# EAGLE design main (EAGLE 5.11)
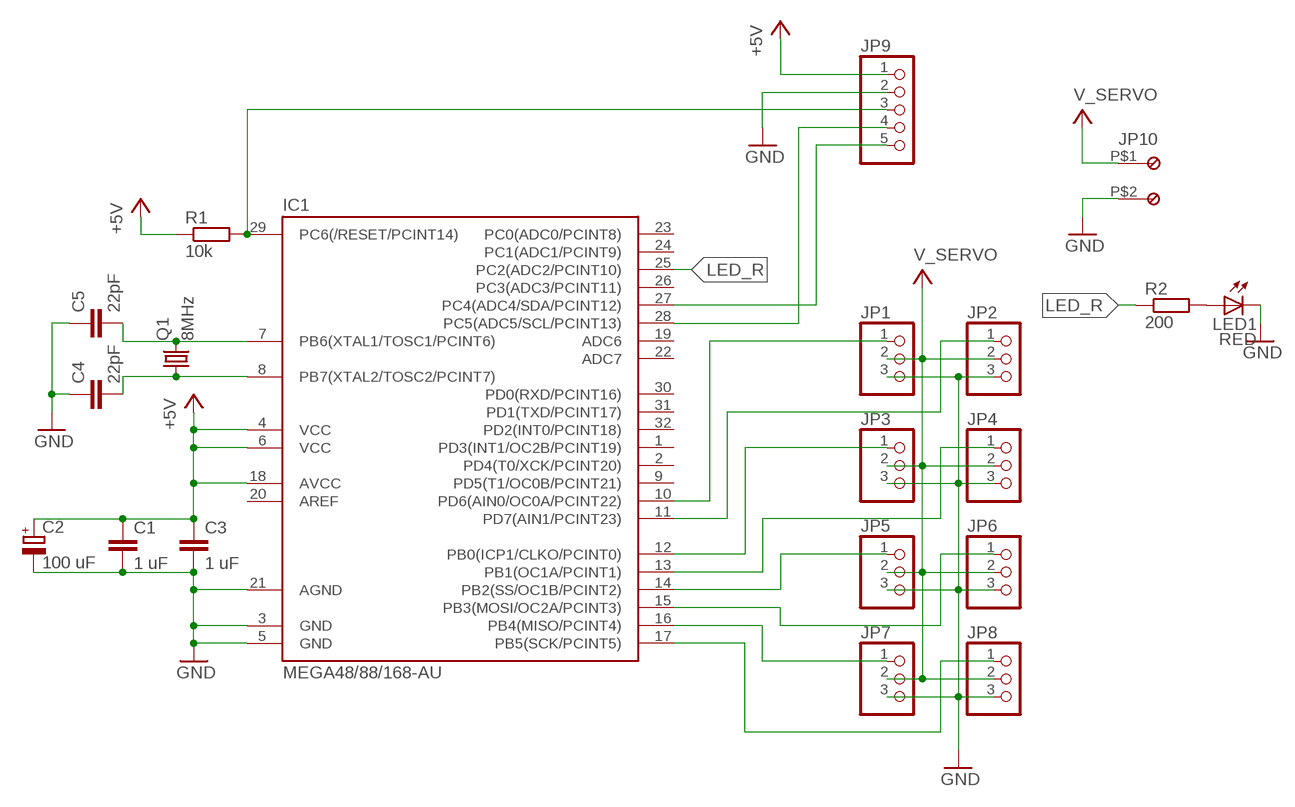
[diagram p0: schematic, sheet 1]

## Parts
C1  1 uF  C-EUC0805  [C0805]
C2  100 uF  CPOL-EUE2-5  [E2-5]
C3  1 uF  C-EUC0805  [C0805]
C4  22pF  C-EUC0805  [C0805]
C5  22pF  C-EUC0805  [C0805]
IC1  MEGA48/88/168-AU  [TQFP32-08]
JP1  PINHD-1X3  [1X03]
JP2  PINHD-1X3  [1X03]
JP3  PINHD-1X3  [1X03]
JP4  PINHD-1X3  [1X03]
JP5  PINHD-1X3  [1X03]
JP6  PINHD-1X3  [1X03]
JP7  PINHD-1X3  [1X03]
JP8  PINHD-1X3  [1X03]
JP9  PINHD-1X5  [1X05]
JP10  KLEM  KLEM5MM  [KLEMM2]
LED1  RED  LED3MM  [LED3MM]
Q1  8MHz  CRYSTALHC49S  [HC49/S]
R1  10k  R-EU_M0805  [M0805]
R2  200  R-EU_M0805  [M0805]

## Nets
+5V: C1.1 C2.+ C3.1 IC1.4(VCC) IC1.6(VCC) IC1.18(AVCC) JP9.1 R1.1
GND: C1.2 C2.- C3.2 C4.1 C5.1 IC1.3(GND) IC1.5(GND) IC1.21(AGND) JP1.3 JP2.3 JP3.3 JP4.3 JP5.3 JP6.3 JP7.3 JP8.3 JP9.2 JP10.P$2 LED1.K(C)
LED_R: IC1.25(PC2(ADC2/PCINT10)) R2.1
N$1: C4.2 IC1.8(PB7(XTAL2/TOSC2/PCINT7)) Q1.1
N$2: C5.2 IC1.7(PB6(XTAL1/TOSC1/PCINT6)) Q1.2
N$3: IC1.29(PC6(/RESET/PCINT14)) JP9.3 R1.2
N$4: IC1.28(PC5(ADC5/SCL/PCINT13)) JP9.4
N$5: IC1.27(PC4(ADC4/SDA/PCINT12)) JP9.5
N$6: IC1.16(PB4(MISO/PCINT4)) JP7.1
N$7: IC1.11(PD7(AIN1/PCINT23)) JP2.1
N$8: IC1.14(PB2(SS/OC1B/PCINT2)) JP5.1
N$9: IC1.12(PB0(ICP1/CLKO/PCINT0)) JP3.1
N$10: IC1.10(PD6(AIN0/OC0A/PCINT22)) JP1.1
N$11: LED1.A R2.2
N$13: IC1.17(PB5(SCK/PCINT5)) JP8.1
N$15: IC1.15(PB3(MOSI/OC2A/PCINT3)) JP6.1
N$16: IC1.13(PB1(OC1A/PCINT1)) JP4.1
V+: JP1.2 JP2.2 JP3.2 JP4.2 JP5.2 JP6.2 JP7.2 JP8.2 JP10.P$1 ; supply symbol labelled V_SERVO
Unconnected: IC1.1(PD3(INT1/OC2B/PCINT19)) IC1.2(PD4(T0/XCK/PCINT20)) IC1.9(PD5(T1/OC0B/PCINT21)) IC1.19(ADC6) IC1.20(AREF) IC1.22(ADC7) IC1.23(PC0(ADC0/PCINT8)) IC1.24(PC1(ADC1/PCINT9)) IC1.26(PC3(ADC3/PCINT11)) IC1.30(PD0(RXD/PCINT16)) IC1.31(PD1(TXD/PCINT17)) IC1.32(PD2(INT0/PCINT18))

## Library data of the parts
C1 C3-C5 = rcl:C-EU: CAPACITOR, European symbol
C2 = rcl:CPOL-EU: POLARIZED CAPACITOR, European symbol
IC1 = avr-7:MEGA48/88/168
JP1-JP8 = pinhead:PINHD-1X3: PIN HEADER
JP9 = pinhead:PINHD-1X5: PIN HEADER
JP10 = klemm:KLEM
LED1 = led:LED: LED OSRAM: - CHIPLED LG R971, LG N971, LY N971, LG Q971, LY Q971, LO R971, LY R971 LH N974, LH R974 LS Q976, LO Q976, LY Q976 LO Q996 - Hyper CHIPLED LW Q18S LB Q993, LB Q99A, LB R99A - SideLED LS A670, LO A670, LY A670, LG A670, LP A670 LB A673, LV A673, LT A673, LW A673 LH A674 LY A675 LS A676, LA A676, LO A676, LY A676, LW A676 LS A679, LY A679, LG A679 - Hyper Micro SIDELED® LS Y876, LA Y876, LO Y876, LY Y876 LT Y87S - SmartLED LW L88C, LW L88S LB L89C, LB L89S, LG L890 LS L89K, LO L89K, LY L89K LS L896, LA L896, LO L896, LY L896 - TOPLED LS T670, LO T670, LY T670, LG T670, LP T670 LSG T670, LSP T670, LSY T670, LOP T670, LYG T670 LG T671, LOG T671, LSG T671 LB T673, LV T673, LT T673, LW T673 LH T674 LS T676, LA T676, LO T676, LY T676, LB T676, LH T676, LSB T676, LW T676 LB T67C, LV T67C, LT T67C, LS T67K, LO T67K, LY T67K, LW E67C LS E67B, LA E67B, LO E67B, LY E67B, LB E67C, LV E67C, LT E67C LW T67C LS T679, LY T679, LG T679 LS T770, LO T770, LY T770, LG T770, LP T770 LB T773, LV T773, LT T773, LW T773 LH T774 LS E675, LA E675, LY E675, LS T675 LS T776, LA T776, LO T776, LY T776, LB T776 LHGB T686 LT T68C, LB T68C - Hyper Mini TOPLED® LB M676 - Mini TOPLED Santana® LG M470 LS M47K, LO M47K, LY M47K Source: http://www.osram.convergy.de LUXEON: - LUMILED® LXK2-PW12-R00, LXK2-PW12-S00, LXK2-PW14-U00, LXK2-PW14-V00 LXK2-PM12-R00, LXK2-PM12-S00, LXK2-PM14-U00 LXK2-PE12-Q00, LXK2-PE12-R00, LXK2-PE12-S00, LXK2-PE14-T00, LXK2-PE14-U00 LXK2-PB12-K00, LXK2-PB12-L00, LXK2-PB12-M00, LXK2-PB14-N00, LXK2-PB14-P00, LXK2-PB14-Q00 LXK2-PR12-L00, LXK2-PR12-M00, LXK2-PR14-Q00, LXK2-PR14-R00 LXK2-PD12-Q00, LXK2-PD12-R00, LXK2-PD12-S00 LXK2-PH12-R00, LXK2-PH12-S00 LXK2-PL12-P00, LXK2-PL12-Q00, LXK2-PL12-R00 Source: www.luxeon.com KINGBRIGHT: KA-3528ASYC Source: www.kingbright.com
Q1 = crystal:CRYSTAL: CRYSTAL; OC_FARNELL: 1667008; OC_NEWARK: unknown
R1 R2 = rcl:R-EU_: RESISTOR, European symbol

## Board
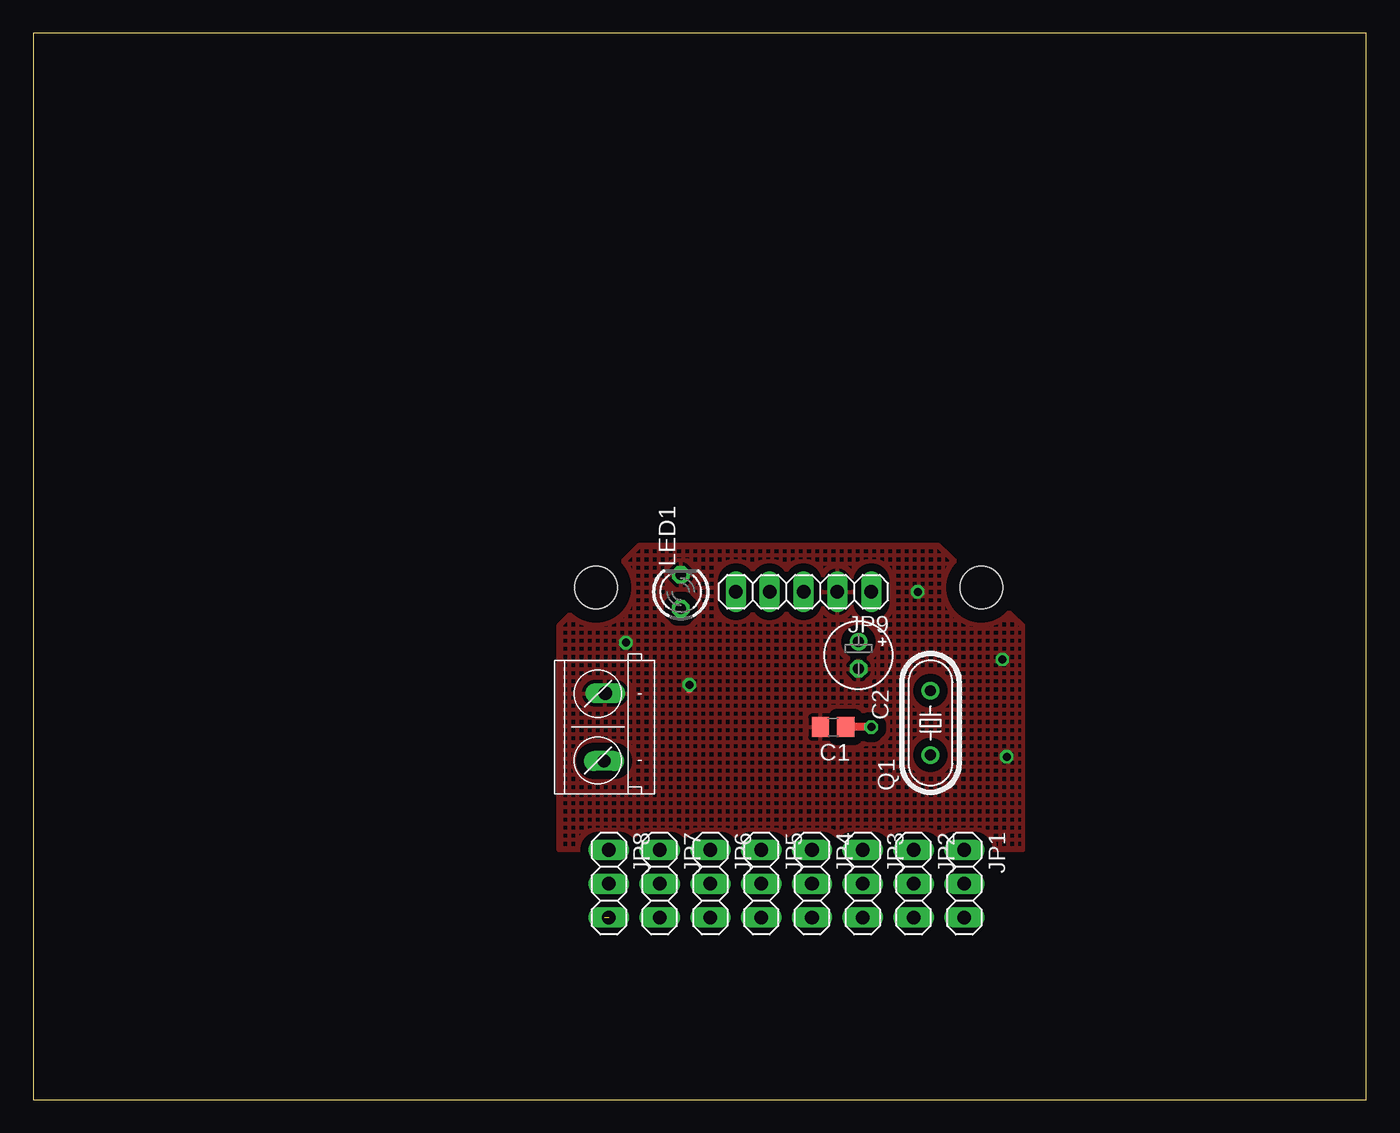
[diagram p1: board, top side]
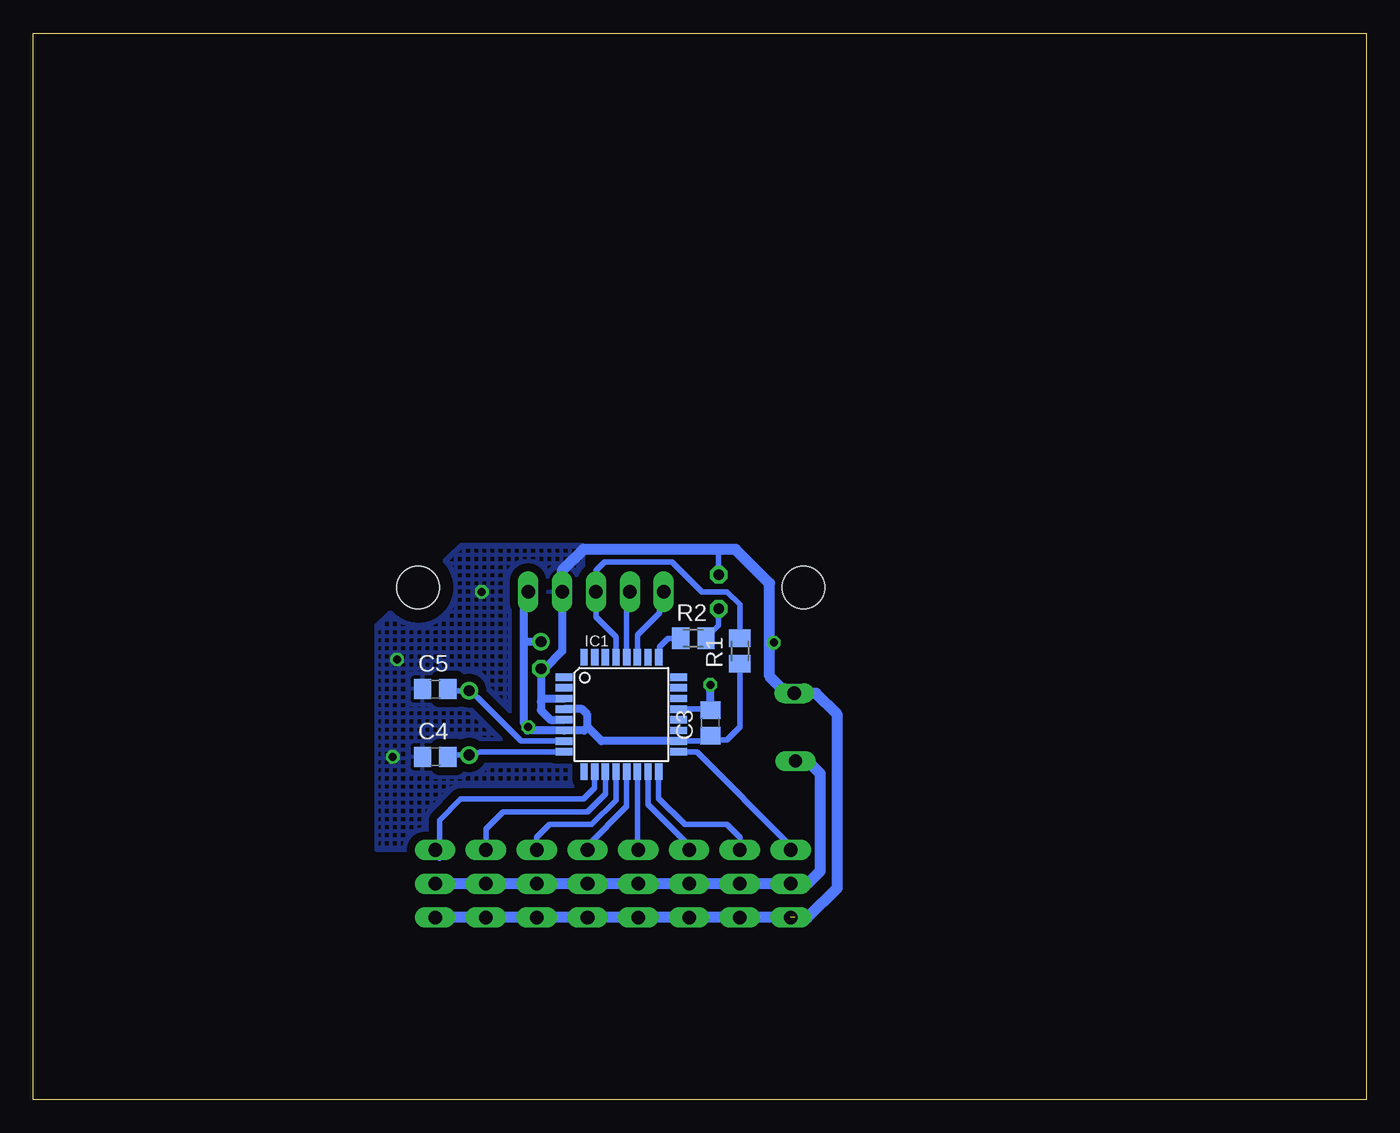
[diagram p2: board, bottom side, seen from below]

Size 100 x 80 mm. Coordinates in mm from the lower left corner, seen from the top.
Outline: 0,0 100,0 100,80 0,80 0,0
Copper layers (1*16): Top 0.035mm / dielectric 1.5mm / Bottom 0.035mm
Design rules "default *": minimum track width 10mil, minimum drill 5mil, track to track 8mil, track to pad 8mil, pad to pad 8mil, via to via 8mil, smd to smd 8mil, copper to edge 40mil, drill to drill 8mil, minimum pad ring 10mil, minimum via ring 8mil, stop-mask expansion 4mil, vias tented up to drill 0mil, thermal gap 10mil
Holes 3.2 mm at 71.12,38.42 42.23,38.42

### Footprints (pad centres in the part's own frame; a part is rotated, then mirrored left to right if it is on the bottom)
C0805 = smd 1.3 x 1.5: 1 -0.95,0; 2 0.95,0
E2-5 = drill 0.813 pad 1.27 round: + -1.016,0 | drill 0.813 pad 1.27 octagon: - 1.016,0
TQFP32-08 = smd 1.27 x 0.559: 1 -4.293,2.8; 2 -4.293,2; 3 -4.293,1.2; 4 -4.293,0.4; 5 -4.293,-0.4; 6 -4.293,-1.2; 7 -4.293,-2; 8 -4.293,-2.8; 17 4.293,-2.8; 18 4.293,-2; 19 4.293,-1.2; 20 4.293,-0.4; 21 4.293,0.4; 22 4.293,1.2; 23 4.293,2; 24 4.293,2.8 | smd 0.559 x 1.27: 9 -2.8,-4.293; 10 -2,-4.293; 11 -1.2,-4.293; 12 -0.4,-4.293; 13 0.4,-4.293; 14 1.2,-4.293; 15 2,-4.293; 16 2.8,-4.293; 25 2.8,4.293; 26 2,4.293; 27 1.2,4.293; 28 0.4,4.293; 29 -0.4,4.293; 30 -1.2,4.293; 31 -2,4.293; 32 -2.8,4.293
1X03 = drill 1.016 long: 1 -2.54,0; 2 0,0; 3 2.54,0
1X05 = drill 1.016 long: 1 -5.08,0; 2 -2.54,0; 3 0,0; 4 2.54,0; 5 5.08,0
KLEMM2 = drill 1 long: P$1 -2.54,0.04; P$2 2.54,-0.04
LED3MM = drill 0.813 octagon: A -1.27,0; K 1.27,0
HC49/S = drill 0.813 round: 1 -2.413,0; 2 2.413,0
M0805 = smd 1.3 x 1.6: 1 -0.95,0; 2 0.95,0

### Placement (x,y rotation side)
C1  60.01,27.94 180 top
C2  61.91,33.34 270 top
C3  49.21,28.26 90 bottom
C4  69.85,25.72 0 bottom
C5  69.85,30.8 0 bottom
IC1  55.88,28.89 0 bottom
JP1  69.85,16.19 270 top
JP2  66.04,16.19 270 top
JP3  62.23,16.19 270 top
JP4  58.42,16.19 270 top
JP5  54.61,16.19 270 top
JP6  50.8,16.19 270 top
JP7  46.99,16.19 270 top
JP8  43.18,16.19 270 top
JP9  57.78,38.1 180 top
JP10  42.86,27.94 90 top
LED1  48.58,38.1 90 top
Q1  67.31,28.26 90 top
R1  46.99,33.66 90 bottom
R2  50.48,34.61 0 bottom

### Tracks (layer width: path | path; a pad name or v marks a point on that pad's centre or on a via)
+5V  (via drill 0.6)
  Top 0.61: v62.87,27.94 C1.1
  Bottom 0.406: IC1.18 49.63,26.89 C3.1 48.9,26.99 47.94,26.99 46.99,27.94 R1.1
  Bottom 0.61: IC1.4 58.82,29.29 58.42,28.89 58.42,27.94 | 58.42,27.94 58.67,27.69 IC1.6 62.93,27.69 62.93,27.94 v62.87,27.94 63.18,28.26 63.18,34.61 | IC1.18 57.37,26.89 58.42,27.94 | JP9.1 62.93,38.04 62.93,37.4 63.18,37.15 63.18,34.61 | C2.+ 62.93,34.35 63.18,34.61
GND  (via drill 0.6)  (1 unrouted)
  Top 0.61: v49.21,31.11 49.21,30.8
  Bottom 0.406: IC1.21 49.21,29.29 C3.2 | LED1.K 48.58,40.96 48.9,41.27
  Bottom 0.61: 49.21,29.29 v49.21,31.11 | IC1.5 61.2,28.49 61.91,29.21 61.91,29.84 | IC1.3 61.66,30.09 61.91,29.84 | 44.77,31.75 44.77,33.97 v44.45,34.29 | JP9.2 60.33,33.66 61.66,32.32 C2.- 61.91,29.84
  Bottom 0.813: JP8.3 JP7.3 JP6.3 JP5.3 JP4.3 JP3.3 JP2.3 JP1.3 | JP9.2 60.33,39.69 58.74,41.27 48.9,41.27 47.31,41.27 44.77,38.73 44.77,31.75 43.5,30.48 JP10.P$2 41.27,30.48 39.69,28.89 39.69,15.88 41.91,13.65 42.86,13.65 43.18,13.34
  other vias: 66.36,38.1 72.71,33.02 73.03,25.72
  pour Top (isolate 0.61, hatched): 39.37,18.73 74.3,18.73 74.3,35.56 67.94,41.59 45.4,41.59 39.37,35.56
  pour Bottom (isolate 0.61, hatched): 58.74,41.59 67.94,41.59 74.3,35.56 74.3,18.73 58.74,18.73 59.05,25.4 60.96,27.3 62.87,27.3 63.18,27.62 63.18,34.92 58.74,39.37
LED_R
  Bottom 0.406: R2.1 52.39,34.61 53.02,33.97 53.02,33.24 IC1.25
N$1
  Bottom 0.406: IC1.8 66.43,26.09 Q1.1 68.46,25.84 C4.2
N$2
  Bottom 0.406: IC1.7 63.41,26.89 66.67,30.16 Q1.2 68.46,30.67 C5.2
N$3
  Bottom 0.406: IC1.29 56.28,34.69 57.78,36.2 JP9.3 57.78,39.69 57.15,40.32 52.07,40.32 49.85,38.1 47.94,38.1 46.99,37.15 R1.2
N$4
  Bottom 0.406: IC1.28 55.48,37.55 JP9.4
N$5
  Bottom 0.406: IC1.27 54.68,34.85 53.02,36.51 53.02,37.47 JP9.5
N$6
  Bottom 0.406: IC1.16 53.08,22.6 51.12,20.64 47.94,20.64 46.99,19.68 JP7.1
N$7
  Bottom 0.406: IC1.11 57.08,22.93 58.42,21.59 64.77,21.59 66.04,20.32 JP2.1
N$8
  Bottom 0.406: IC1.14 54.68,18.8 JP5.1
N$9
  Bottom 0.406: IC1.12 56.28,22.46 58.1,20.64 61.28,20.64 62.23,19.68 JP3.1
N$10
  Bottom 0.406: IC1.10 57.88,23.4 58.74,22.54 67.94,22.54 69.53,20.95 69.53,18.1 JP1.1
N$11
  Bottom 0.406: LED1.A 48.58,35.56 R2.2
N$13
  Bottom 0.406: IC1.17 50.22,26.09 43.18,19.05 JP8.1
N$15
  Bottom 0.406: IC1.15 53.88,22.13 51.12,19.37 51.12,19.05 JP6.1
N$16
  Bottom 0.406: IC1.13 55.48,21.99 58.42,19.05 JP4.1
V+
  Bottom 0.813: JP1.2 JP2.2 JP3.2 JP4.2 JP5.2 JP6.2 JP7.2 JP8.2 41.91,16.19 40.96,17.14 40.96,24.45 41.91,25.4 JP10.P$1